# EAGLE schematic 209_ktemp (EAGLE 7.6.0)
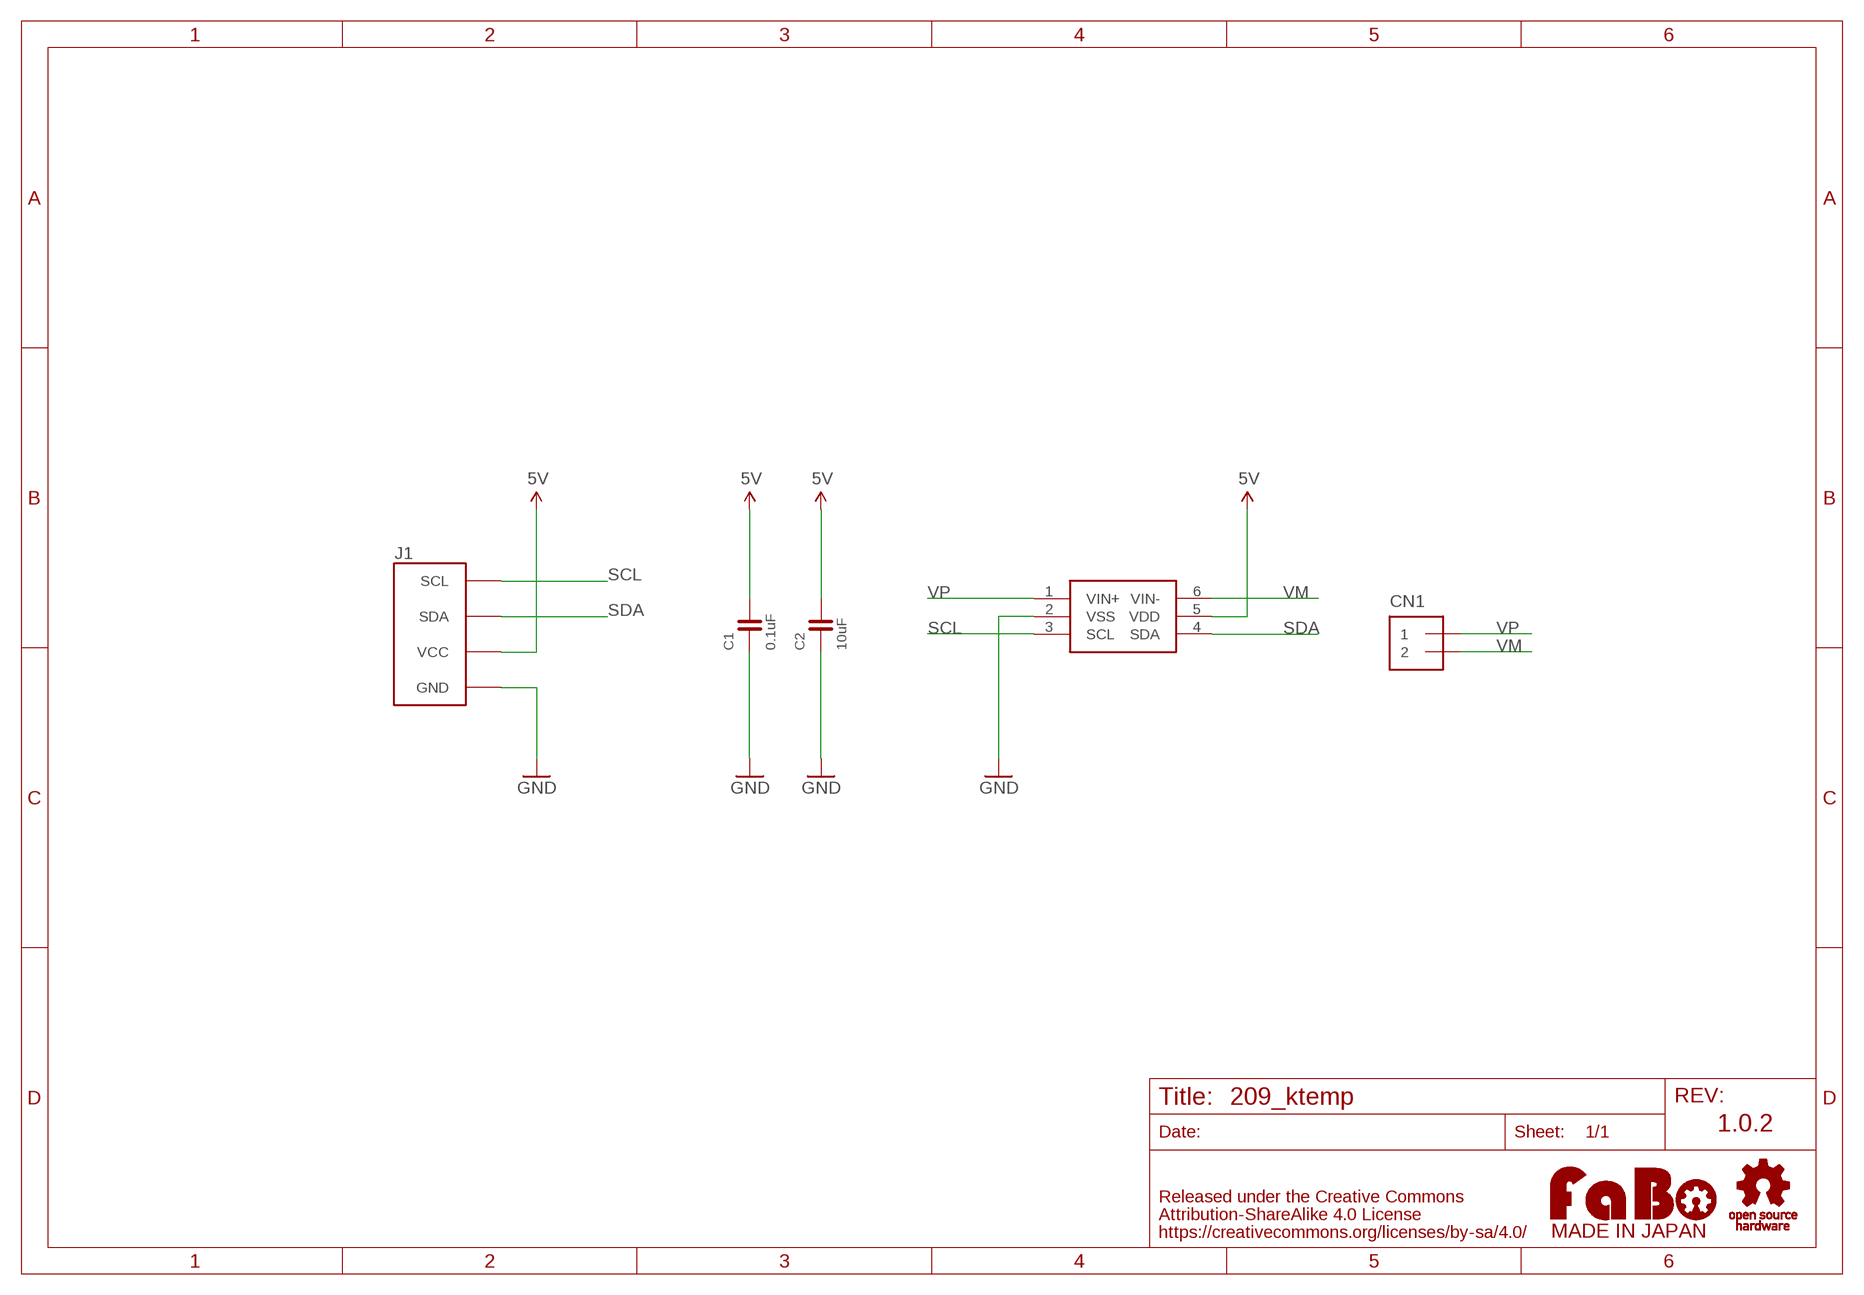
[diagram p0: schematic, sheet 1]

## Parts
C1  0.1uF  CAPACITOR-0603  [0603]
C2  10uF  CAPACITOR-0603  [0603]
CN1  PIN_HEADER_1X2  [PIN_1X2_LONG]
J1  FABO_BRICK_I2C  [FABO_BRICK_I2C]
U$2  MICROCHIP-MCP3421  [MICROCHIP-MCP3421]
U$3  LOGO_OSHW-M_BOTTOM  [LOGO_OSHW_M_BOTTOM]
U$4  LOGO_FABO-M  [LOGO_FABO_MS]

## Nets
5V: C1.2 C2.2 J1.VCC U$2.5(VDD)
GND: C1.1 C2.1 J1.GND U$2.2(VSS)
SCL: J1.SCL U$2.3(SCL)
SDA: J1.SDA U$2.4(SDA)
VM: CN1.2 U$2.6(VIN-)
VP: CN1.1 U$2.1(VIN+)

## Notes on the sheet
- 1.0.2

## Library data of the parts
C1 C2 = FaBo-Capacitor:CAPACITOR: CAPACITOR
CN1 = FaBo-PIN:PIN_HEADER_1X2
J1 = FaBo-Template:FABO_BRICK_I2C: FaBo Brick I2C
U$2 = gclueSensor:MICROCHIP-MCP3421
U$3 = FaBo-etc:LOGO_OSHW
U$4 = FaBo-etc:LOGO_FABO